# EAGLE design motorboard_v1.2 (EAGLE 7.1.0)
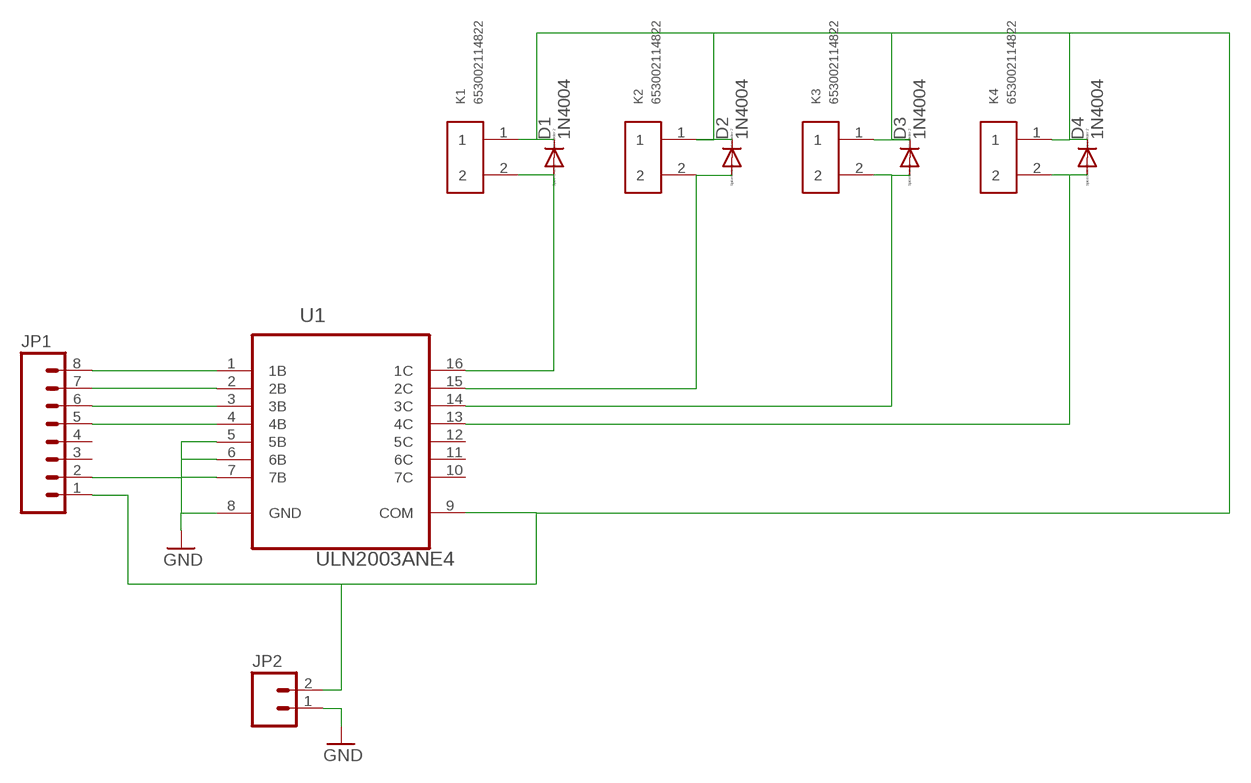
[diagram p0: schematic, sheet 1]

## Parts
D1  1N4004  [DO41-10]
D2  1N4004  [DO41-10]
D3  1N4004  [DO41-10]
D4  1N4004  [DO41-10]
JP1  M08NO_SILK_FEMALE_PTH  [1X08_NO_SILK]
JP2  M02LOCK_LONGPADS  [1X02_LOCK_LONGPADS]
K1  653002114822  [653002114822]
K2  653002114822  [653002114822]
K3  653002114822  [653002114822]
K4  653002114822  [653002114822]
U1  ULN2003ANE4  [DIP254P762X508-16]

## Nets
GND: JP1.2 JP2.1 U1.5(5B) U1.6(6B) U1.7(7B) U1.8(GND)
N$1: D1.C D2.C D3.C D4.C JP1.1 JP2.2 K1.1 K2.1 K3.1 K4.1 U1.9(COM)
N$3: JP1.8 U1.1(1B)
N$4: JP1.7 U1.2(2B)
N$5: JP1.6 U1.3(3B)
N$6: JP1.5 U1.4(4B)
N$7: D1.A K1.2 U1.16(1C)
N$8: D2.A K2.2 U1.15(2C)
N$9: D3.A K3.2 U1.14(3C)
N$10: D4.A K4.2 U1.13(4C)
Unconnected: JP1.3 JP1.4 U1.10(7C) U1.11(6C) U1.12(5C)

## Library data of the parts
D1-D4 = diode:1N4004: DIODE general purpose rectifier, 1 A; MF: NTE ELECTRONICS; MPN: 1N4004; OC_FARNELL: 2295710
JP1 = SparkFun-Connectors:M08: Header 8 Standard 8-pin 0.1" header. Use with straight break away headers (SKU : PRT-00116), right angle break away headers (PRT-00553), swiss pins (PRT-00743), machine pins (PRT-00117), and female headers (PRT-00115).; OC_FARNELL: unknown; PROD_ID: CONN-08438
JP2 = SparkFun-Connectors:M02: Standard 2-pin 0.1" header. Use with - straight break away headers ( PRT-00116) - right angle break away headers (PRT-00553) - swiss pins (PRT-00743) - machine pins (PRT-00117) - female headers (PRT-00115) Molex polarized connector foot print use with: PRT-08233 with associated crimp pins and housings. 2.54_SCREWTERM for use with PRT-10571. 3.5mm Screw Terminal footprints for PRT-08084 5mm Screw Terminal footprints for use with PRT-08432
K1-K4 = Wuerth_Elektronik_eiCan_Wire_to_Board_Connectors:653002114822: WR-WTB 1.25mm Male Vertical Shrouded Header, 2 Pins=>Code : Con_WTB_1.25_PCB_THT_653002114822 <http://katalog.we-online.de/media/thumbs2/eican/thb_Con_WTB_1.25_PCB_THT_6530xx114822_pf2.jpg> Details see: http://katalog.we-online.de/en/em/653_0xx_114_822 Created 2014-06-06, Karrer Zheng 2014 (C) Würth Elektronik; OC_FARNELL: unknown
U1 = Texas Instruments_By_element14_Batch_1:ULN2003ANE4: HIGH-VOLTAGE, HIGH-CURRENT DARLINGTON TRANSISTOR ARRAYS; MPN: ULN2003ANE4; OC_FARNELL: 1210973; OC_NEWARK: 98K2130; PACKAGE: PDIP-16; SUPPLIER: Texas Instruments

## Board
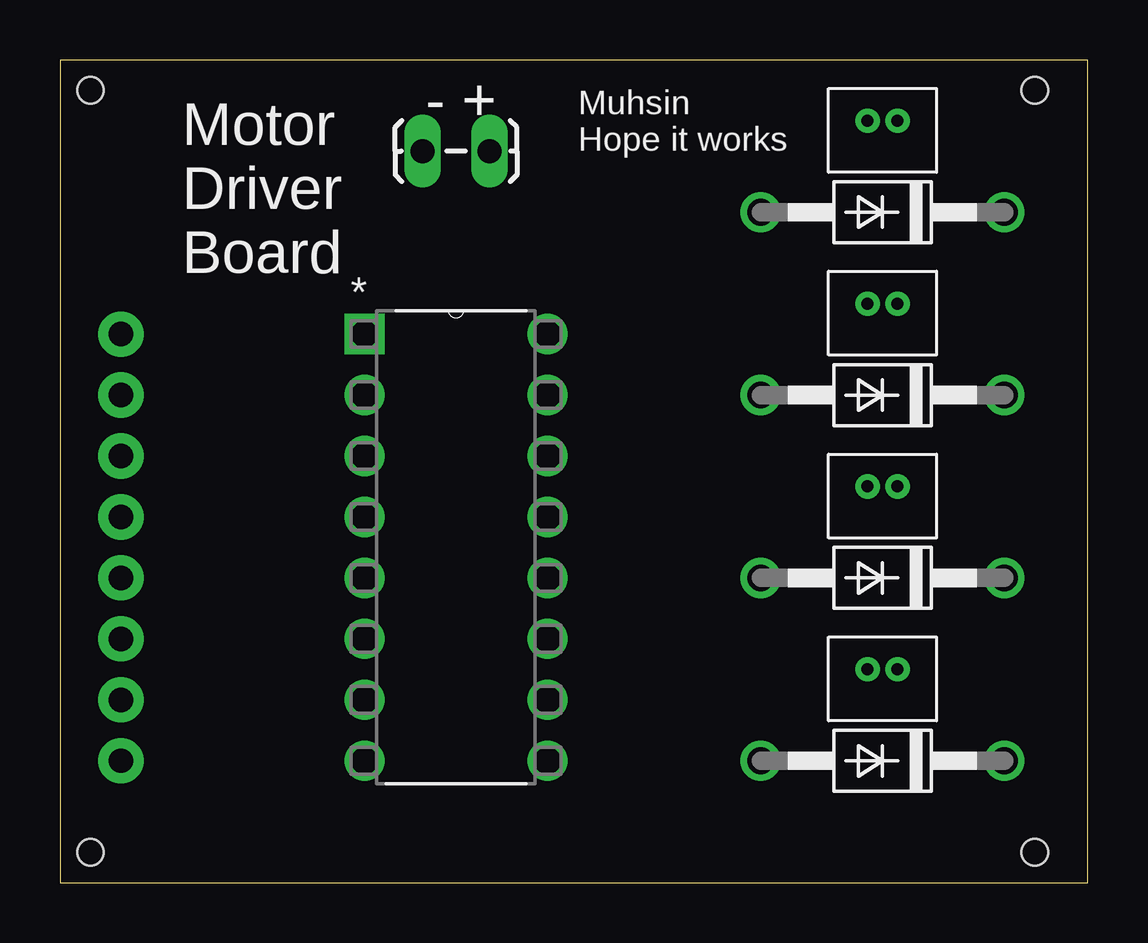
[diagram p1: board, top side]
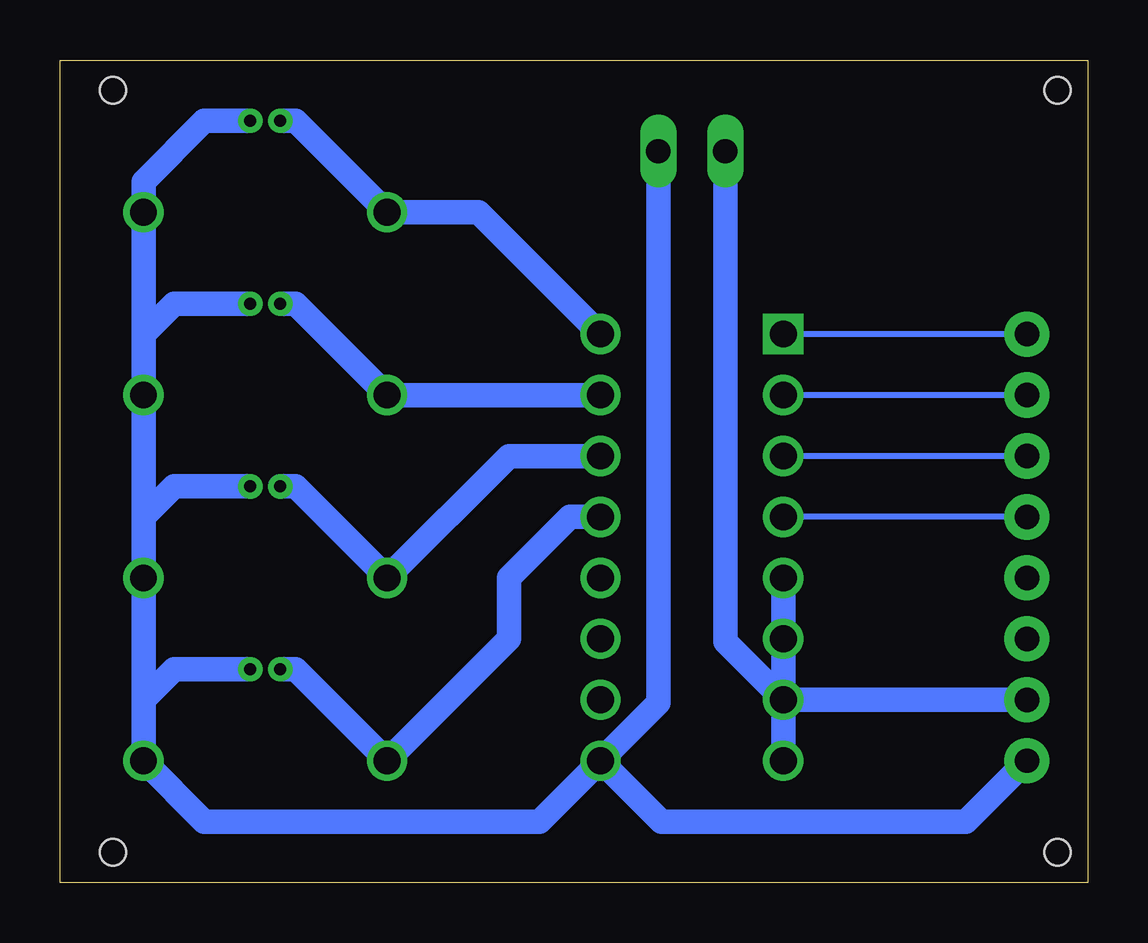
[diagram p2: board, bottom side, seen from below]

Size 42.85 x 34.28 mm. Coordinates in mm from the lower left corner, seen from the top.
Outline: 0,0 42.85,0 42.85,34.28 0,34.28 0,0
Copper layers (1*16): Top 0.035559375mm / dielectric 1.501140625mm / Bottom 0.035559375mm
Design rules "4pcb-33board": minimum track width 10mil, minimum drill 15mil, track to track 6mil, track to pad 6mil, pad to pad 6mil, via to via 6mil, smd to smd 6mil, copper to edge 10mil, drill to drill 10mil, minimum pad ring 10mil, minimum via ring 8mil, stop-mask expansion 4mil, vias tented up to drill 0mil, thermal gap 10mil
Holes 1.1 mm at 1.27,1.27 40.64,1.27 1.27,33.02 40.64,33.02

### Footprints (pad centres in the part's own frame; a part is rotated, then mirrored left to right if it is on the bottom)
DO41-10 = drill 1.118: A 5.08,0; C -5.08,0
1X08_NO_SILK = drill 1.016 pad 1.88: 1 0,0; 2 2.54,0; 3 5.08,0; 4 7.62,0; 5 10.16,0; 6 12.7,0; 7 15.24,0; 8 17.78,0
1X02_LOCK_LONGPADS = drill 1.016 long: 1 -0.127,0; 2 2.667,0
653002114822 = drill 0.5: 1 0.625,0; 2 -0.625,0
DIP254P762X508-16 = drill 1.118 square: 1 -7.62,17.78 | drill 1.118: 2 -7.62,15.24; 3 -7.62,12.7; 4 -7.62,10.16; 5 -7.62,7.62; 6 -7.62,5.08; 7 -7.62,2.54; 8 -7.62,0; 9 0,0; 10 0,2.54; 11 0,5.08; 12 0,7.62; 13 0,10.16; 14 0,12.7; 15 0,15.24; 16 0,17.78

### Placement (x,y rotation side)
D1  34.29,27.94 180 top
D2  34.29,20.32 180 top
D3  34.29,12.7 180 top
D4  34.29,5.08 180 top
JP1  2.54,5.08 90 top
JP2  15.24,30.48 0 top
K1  34.29,31.75 0 top
K2  34.29,24.13 0 top
K3  34.29,16.51 0 top
K4  34.29,8.89 0 top
U1  20.32,5.08 0 top

### Tracks (layer width: path | path; a pad name or v marks a point on that pad's centre or on a via)
GND
  Bottom 1.016: JP1.2 U1.7 | U1.5 U1.6 U1.7 | U1.7 U1.8 | JP2.1 15.11,10.03 U1.7
N$1
  Bottom 1.016: JP1.1 5.08,2.54 17.78,2.54 U1.9 | JP2.2 17.91,7.49 U1.9 | U1.9 22.86,2.54 36.83,2.54 D4.C 39.37,7.62 | 39.37,7.62 D3.C | D3.C D2.C | D2.C D1.C 39.37,29.21 36.83,31.75 K1.1 | D2.C 39.37,22.86 38.1,24.13 K2.1 | D3.C 39.37,15.24 38.1,16.51 K3.1 | K4.1 38.1,8.89 39.37,7.62
N$3
  Bottom 0.254: JP1.8 U1.1
N$4
  Bottom 0.254: JP1.7 U1.2
N$5
  Bottom 0.254: JP1.6 U1.3
N$6
  Bottom 0.254: JP1.5 U1.4
N$7
  Bottom 1.016: K1.2 33.02,31.75 D1.A 25.4,27.94 U1.16
N$8
  Bottom 1.016: K2.2 33.02,24.13 D2.A U1.15
N$9
  Bottom 1.016: K3.2 33.02,16.51 D3.A 24.13,17.78 U1.14
N$10
  Bottom 1.016: K4.2 33.02,8.89 D4.A 24.13,10.16 24.13,12.7 21.59,15.24 U1.13

### Text on the board
tPlace: - + | Muhsin / Hope it works | Motor / Driver / Board